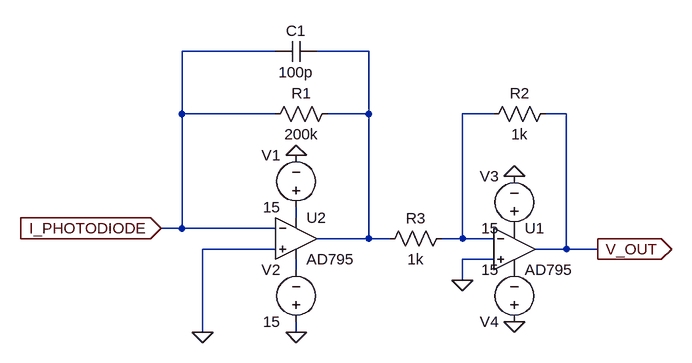
[diagram p0: schematic photodiode_model_TIA.asc]
photodiode_model_TIA.asc, the LTspice schematic file:
Version 4.1
SHEET 1 880 680
WIRE 112 -208 -32 -208
WIRE 256 -208 176 -208
WIRE -32 -112 -32 -208
WIRE 112 -112 -32 -112
WIRE 256 -112 256 -208
WIRE 256 -112 192 -112
WIRE 448 -112 400 -112
WIRE 560 -112 528 -112
WIRE 144 48 144 32
WIRE -32 64 -32 -112
WIRE -32 64 -64 64
WIRE 112 64 -32 64
WIRE 256 80 256 -112
WIRE 256 80 176 80
WIRE 288 80 256 80
WIRE 400 80 400 -112
WIRE 400 80 368 80
WIRE 448 80 400 80
WIRE 112 96 0 96
WIRE 560 96 560 -112
WIRE 560 96 512 96
WIRE 608 96 560 96
WIRE 448 112 400 112
WIRE 144 128 144 112
WIRE 400 144 400 112
WIRE 0 224 0 96
WIRE 144 224 144 208
FLAG 0 224 0
FLAG -64 64 I_PHOTODIODE
IOPIN -64 64 In
FLAG 608 96 V_OUT
IOPIN 608 96 Out
FLAG 144 -48 0
FLAG 144 224 0
FLAG 480 -16 0
FLAG 480 208 0
FLAG 400 144 0
SYMBOL res 96 -96 R270
WINDOW 0 32 56 VTop 2
WINDOW 3 0 56 VBottom 2
SYMATTR InstName R1
SYMATTR Value 200k
SYMBOL OpAmps\\AD795 144 16 R0
SYMATTR InstName U2
SYMBOL cap 176 -224 R90
WINDOW 0 0 32 VBottom 2
WINDOW 3 32 32 VTop 2
SYMATTR InstName C1
SYMATTR Value 100p
SYMBOL voltage 144 48 R180
WINDOW 0 24 96 Left 2
WINDOW 3 24 16 Left 2
WINDOW 123 0 0 Left 0
WINDOW 39 0 0 Left 0
SYMATTR InstName V1
SYMATTR Value 15
SYMBOL voltage 144 224 R180
WINDOW 0 24 96 Left 2
WINDOW 3 24 16 Left 2
WINDOW 123 0 0 Left 0
WINDOW 39 0 0 Left 0
SYMATTR InstName V2
SYMATTR Value 15
SYMBOL OpAmps\\AD795 480 32 R0
SYMATTR InstName U1
SYMBOL voltage 480 80 R180
WINDOW 0 24 96 Left 2
WINDOW 3 24 16 Left 2
WINDOW 123 0 0 Left 0
WINDOW 39 0 0 Left 0
SYMATTR InstName V3
SYMATTR Value 15
SYMBOL voltage 480 224 R180
WINDOW 123 0 0 Left 0
WINDOW 39 0 0 Left 0
SYMATTR InstName V4
SYMATTR Value 15
SYMBOL res 544 -128 R90
WINDOW 0 0 56 VBottom 2
WINDOW 3 32 56 VTop 2
SYMATTR InstName R2
SYMATTR Value 1k
SYMBOL res 384 64 R90
WINDOW 0 0 56 VBottom 2
WINDOW 3 32 56 VTop 2
SYMATTR InstName R3
SYMATTR Value 1k

The netlist it stands for:
* photodiode_model_TIA.asc
R1 I_PHOTODIODE N001 200k
X§U2 0 I_PHOTODIODE N003 N004 N001 AD795  ; pins In+ In- V+ V- OUT
C1 N001 I_PHOTODIODE 100p
V1 N003 0 15
V2 0 N004 15
X§U1 0 N002 P001 P002 V_OUT AD795  ; pins In+ In- V+ V- OUT
V3 P001 0 15
V4 0 P002 15
R2 V_OUT N002 1k
R3 N002 N001 1k
.lib ADI1.lib
.backanno
.end